# EAGLE design grintch_pcb (EAGLE 9.6.2)
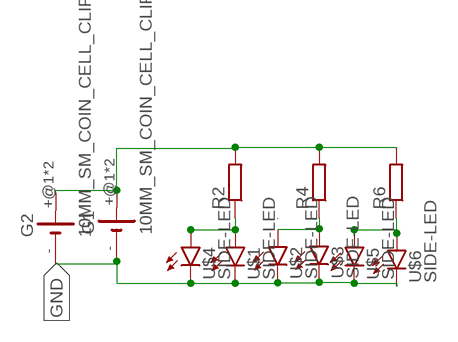
[diagram p0: schematic, sheet 1]

## Parts
G1  10MM_SM_COIN_CELL_CLIP  [10MM_SM_COIN_CELL_CLIP]
G2  10MM_SM_COIN_CELL_CLIP  [10MM_SM_COIN_CELL_CLIP]
R2  R-EU_R0805  [R0805]
R4  R-EU_R0805  [R0805]
R6  R-EU_R0805  [R0805]
U$1  SIDE-LED  [SIDE-LED]
U$2  SIDE-LED  [SIDE-LED]
U$3  SIDE-LED  [SIDE-LED]
U$4  SIDE-LED  [SIDE-LED]
U$5  SIDE-LED  [SIDE-LED]
U$6  SIDE-LED  [SIDE-LED]

## Nets
GND: G1.- G2.- U$1.P$2(C) U$2.P$2(C) U$3.P$2(C) U$4.P$2(C) U$5.P$2(C) U$6.P$2(C)
N$4: G1.+@1(+) G1.+@2(+) G2.+@1(+) G2.+@2(+) R2.2 R4.2 R6.2
N$7: R2.1 U$1.P$1(A) U$4.P$1(A)
N$10: R4.1 U$2.P$1(A) U$3.P$1(A)
N$11: R6.1 U$5.P$1(A) U$6.P$1(A)

## Library data of the parts
G1 G2 = battery:10MM_SM_COIN_CELL_CLIP: Battery cell clip for CR927 Source: KEYSTONE ELECTRONICS CORP. www.keyelco.com, ASTORIA, N.Y. 11105-2017 PART ANME 10mm SM COIN CELl CLIP DWG NO. 3030
R2 R4 R6 = rcl:R-EU_: RESISTOR, European symbol; SPICEPREFIX: R
U$1-U$6 = led:SIDE-LED

## Board
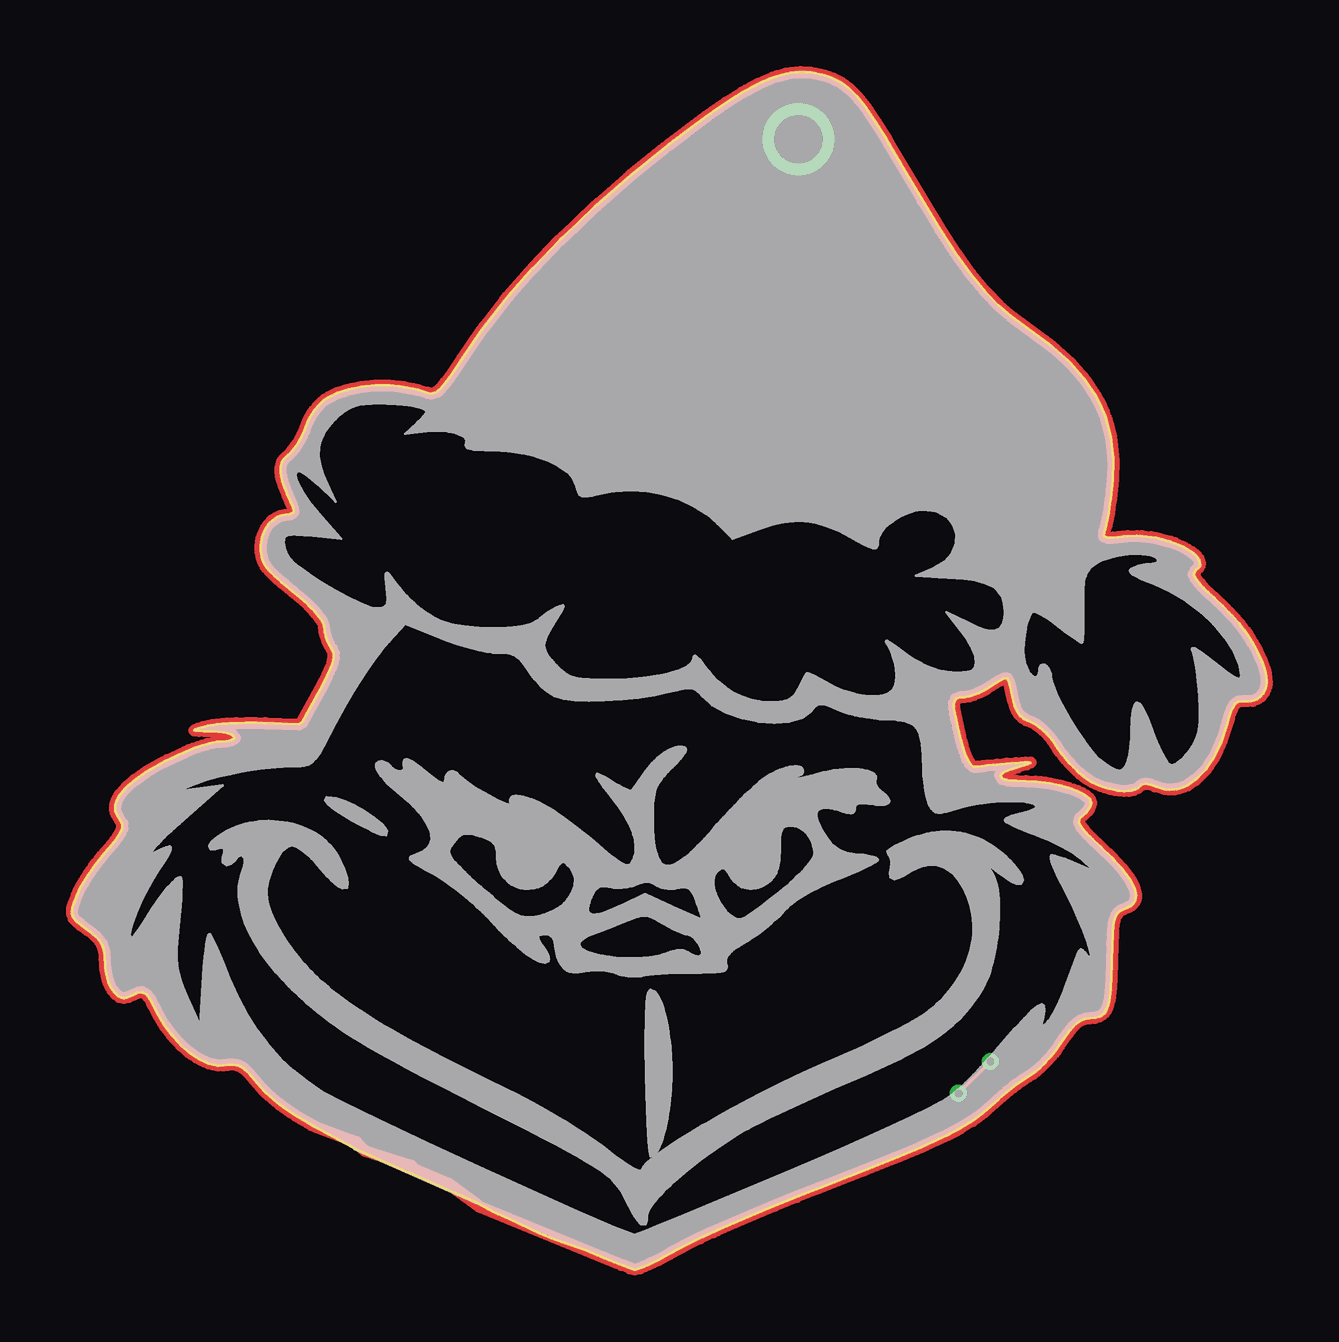
[diagram p1: board, top side]
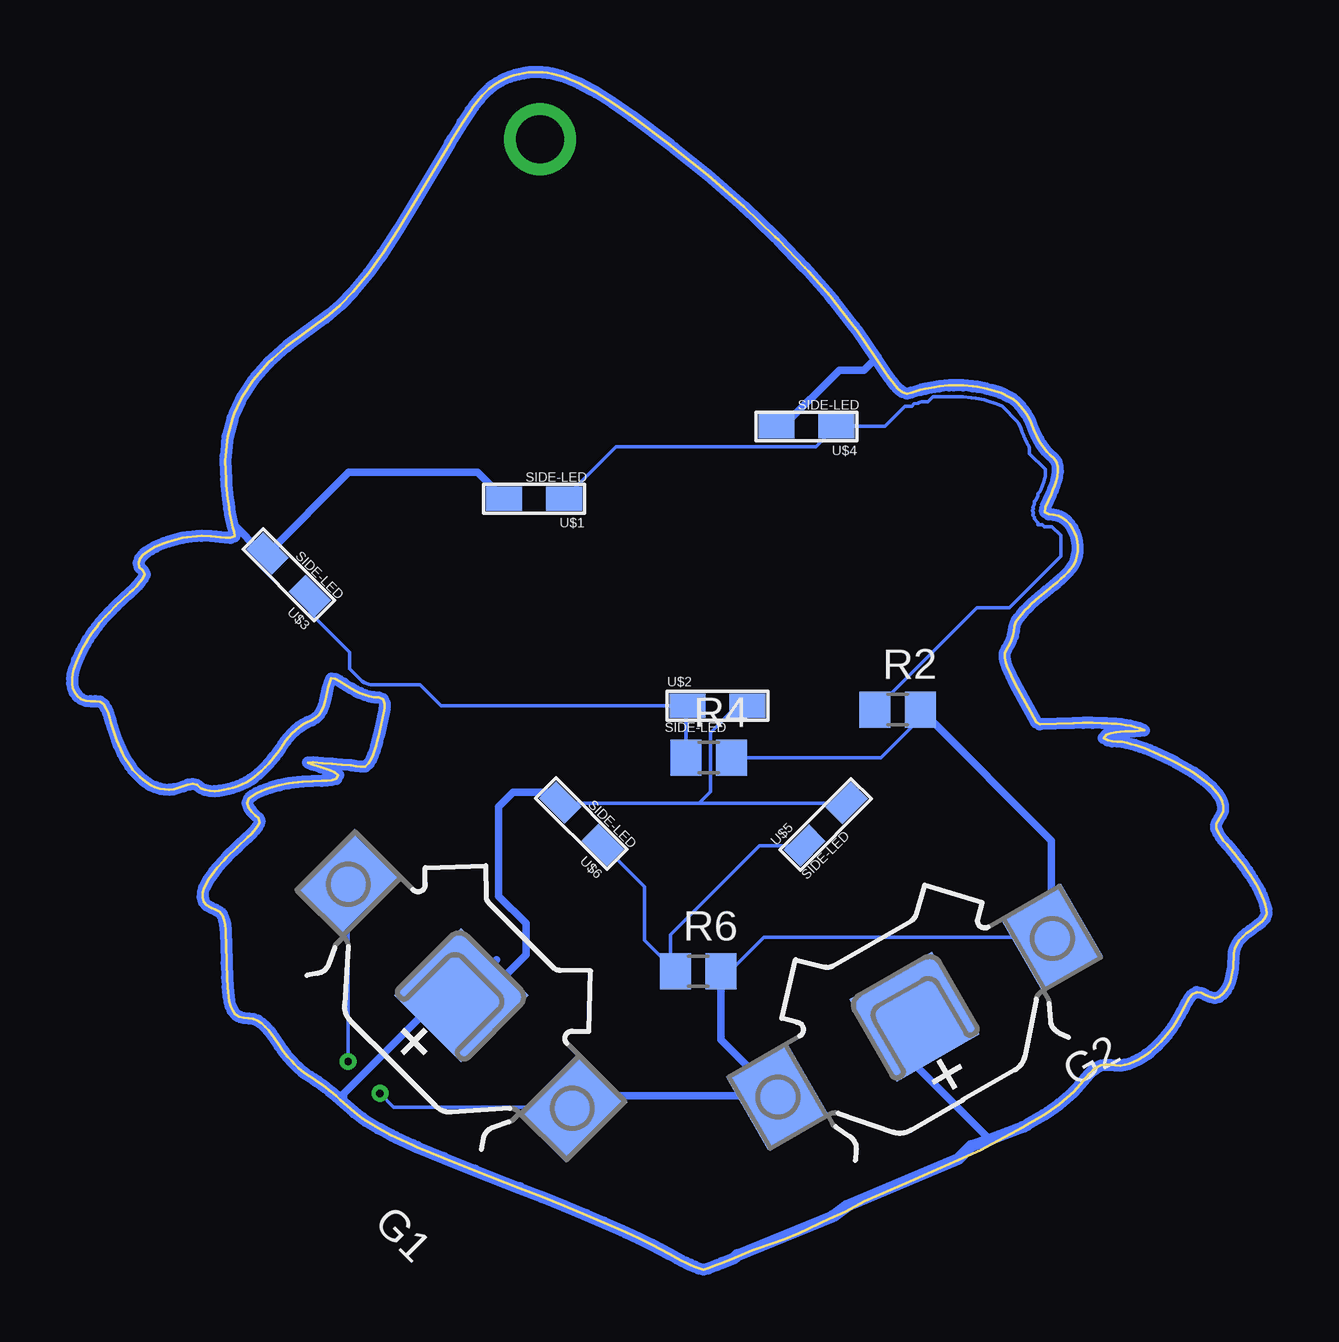
[diagram p2: board, bottom side, seen from below]

Size 49.79 x 49.9 mm. Coordinates in mm from the lower left corner, seen from the top.
Outline: 16.77,2.84 15.04,3.6 14.85,3.68 13.57,4.24 13.38,4.32 11.94,4.98 11.43,5.24 10.16,5.93 9.98,6.03 9.3,6.43 9.13,6.54 8.64,6.89 8.48,7.02 8.03,7.41 7.64,7.86 7.51,8.02 7.38,8.17 7.24,8.31 7.08,8.43 6.9,8.51 6.7,8.54 6.5,8.53 6.3,8.51 6.1,8.5 5.91,8.54 5.71,8.58 5.53,8.66 5.35,8.75 5.18,8.85 5.01,8.96 4.85,9.08 4.55,9.34 4.41,9.48 4.28,9.63 4.15,9.78 3.91,10.1 3.8,10.27 3.6,10.62 3.51,10.79 3.42,10.97 3.32,11.15 3.21,11.32 3.09,11.47 2.92,11.56 2.72,11.53 2.54,11.44 2.36,11.36 2.17,11.31 1.98,11.36 1.82,11.49 1.69,11.64 1.59,11.81 1.52,12 1.46,12.19 1.42,12.38 1.39,12.58 1.38,12.78 1.37,12.98 1.36,13.18 1.31,13.38 1.24,13.56 1.13,13.73 1,13.88 0.84,14.01 0.69,14.13 0.36,14.36 0.21,14.49 0.07,14.64 0,14.82 0.01,15.02 0.06,15.21 0.13,15.4 0.2,15.59 0.28,15.77 0.37,15.94 0.47,16.12 0.58,16.29 0.69,16.46 0.8,16.62 0.91,16.78 1.03,16.95 1.15,17.1 1.28,17.26 1.67,17.72 1.79,17.87 1.91,18.03 2.02,18.2 2.1,18.38 2.09,18.58 1.89,18.92 1.81,19.1 1.81,19.3 1.85,19.49 1.93,19.68 2.04,19.84 2.17,19.99 2.31,20.14 2.61,20.4 2.77,20.51 3.1,20.74 3.27,20.84 3.8,21.14 3.97,21.23 4.7,21.57 4.88,21.64 5.07,21.71 5.26,21.78 5.45,21.84 5.64,21.9 5.83,21.95 6.03,21.99 6.23,22 6.43,22.01 6.62,22.05 6.79,22.15 6.68,22.29 6.49,22.36 6.29,22.39 6.09,22.41 5.89,22.43 5.49,22.44 5.29,22.44 5.1,22.47 5.28,22.55 5.47,22.61 5.66,22.66 5.86,22.69 6.06,22.72 6.26,22.74 6.46,22.75 6.66,22.76 6.86,22.77 7.26,22.78 7.66,22.78 8.06,22.77 9.45,22.72 9.6,22.81 10.37,24.21 10.55,24.56 10.64,24.74 10.73,24.92 10.81,25.11 10.87,25.29 10.92,25.49 10.91,25.69 10.83,25.87 10.73,26.04 10.64,26.22 10.57,26.41 10.53,26.6 10.51,26.8 10.44,26.99 10.33,27.16 10.21,27.31 10.08,27.46 9.94,27.61 9.79,27.75 9.65,27.88 9.5,28.01 9.19,28.27 8.88,28.52 8.72,28.65 8.57,28.78 8.43,28.91 8.28,29.05 8.15,29.21 8.04,29.37 7.95,29.55 7.9,29.74 7.87,29.94 7.87,30.14 7.89,30.34 7.94,30.53 8,30.72 8.09,30.9 8.2,31.06 8.34,31.21 8.5,31.32 8.69,31.4 8.88,31.45 9.08,31.47 9.24,31.57 9.22,31.76 8.97,32.31 8.9,32.49 8.83,32.68 8.77,32.87 8.72,33.07 8.7,33.26 8.7,33.46 8.76,33.65 8.87,33.82 9.02,33.95 9.17,34.09 9.29,34.24 9.4,34.41 9.5,34.58 9.6,34.76 9.68,34.94 9.83,35.31 9.91,35.49 10.02,35.66 10.13,35.83 10.25,35.98 10.39,36.13 10.54,36.26 10.72,36.36 11.08,36.53 11.46,36.65 11.65,36.7 12.04,36.78 12.24,36.8 12.64,36.84 13.04,36.84 13.24,36.84 13.64,36.8 13.83,36.77 14.23,36.7 14.42,36.65 14.8,36.54 15,36.5 15.18,36.57 15.34,36.69 15.48,36.83 15.6,36.99 15.72,37.15 15.95,37.48 16.28,37.98 17.07,39.14 17.19,39.29 18.05,40.4 18.18,40.55 19.1,41.6 19.23,41.75 20.34,42.9 20.48,43.04 21.79,44.28 21.94,44.42 23.29,45.6 24.69,46.73 24.85,46.86 26.45,48.05 27.27,48.62 27.95,49.05 28.12,49.15 28.65,49.43 29.2,49.66 29.39,49.73 29.78,49.83 29.97,49.86 30.17,49.89 30.37,49.9 30.77,49.88 30.97,49.85 31.16,49.81 31.36,49.76 31.55,49.69 31.73,49.62 31.91,49.53 32.09,49.44 32.25,49.32 32.41,49.2 32.69,48.92 32.82,48.76 33.07,48.45 33.18,48.29 33.52,47.79 33.94,47.11 34.04,46.94 35.46,44.53 36.19,43.34 36.85,42.33 36.97,42.17 37.44,41.52 37.56,41.36 38.07,40.75 38.62,40.17 39.08,39.78 39.23,39.66 40.69,38.6 40.84,38.47 41.44,37.94 41.59,37.8 42.12,37.21 42.24,37.05 42.69,36.39 42.78,36.21 43.03,35.66 43.1,35.48 43.3,34.7 43.33,34.51 43.39,33.91 43.4,33.71 43.38,32.91 43.36,32.71 43.34,32.51 43.3,32.12 43.27,31.92 43.24,31.72 43.21,31.52 43.17,31.33 43.14,31.13 43.09,30.94 43.02,30.75 43.01,30.55 43.2,30.49 43.4,30.5 43.59,30.52 43.79,30.54 43.99,30.56 44.39,30.57 44.59,30.57 44.99,30.52 45.19,30.49 45.77,30.34 45.95,30.27 46.32,30.11 46.49,30.01 46.66,29.9 46.82,29.78 46.95,29.63 47.01,29.45 46.98,29.27 46.84,29.13 46.75,28.97 46.84,28.79 46.96,28.63 47.1,28.48 47.23,28.34 47.38,28.2 47.97,27.66 48.25,27.37 48.38,27.23 48.65,26.93 48.77,26.77 48.89,26.61 49,26.44 49.11,26.28 49.22,26.11 49.32,25.93 49.41,25.76 49.58,25.39 49.72,25.02 49.76,24.83 49.79,24.63 49.79,24.43 49.76,24.23 49.68,24.05 49.56,23.89 49.4,23.77 49.21,23.7 49.02,23.68 48.82,23.69 48.62,23.66 48.46,23.55 48.36,23.38 48.28,23.19 48.22,23 48.17,22.81 48.11,22.62 47.92,22.05 47.85,21.86 47.68,21.5 47.59,21.32 47.37,20.99 47.25,20.83 46.98,20.54 46.83,20.4 46.5,20.18 46.31,20.11 46.13,20.04 45.93,20.01 45.73,20 45.53,20.02 45.15,20.13 44.96,20.21 44.77,20.24 44.58,20.19 44.43,20.06 44.25,19.98 44.05,19.95 43.85,19.94 43.65,19.96 43.46,19.99 43.26,20.03 43.07,20.08 42.88,20.15 42.7,20.23 42.52,20.32 42.35,20.42 42.18,20.53 42.03,20.66 41.88,20.79 41.74,20.93 41.6,21.08 41.47,21.23 41.34,21.38 41.22,21.54 41.1,21.7 40.99,21.87 40.88,22.04 40.76,22.19 40.62,22.34 40.48,22.48 40.32,22.61 40.16,22.72 39.98,22.81 39.8,22.88 39.63,22.99 39.48,23.13 39.38,23.3 39.3,23.48 39.25,23.67 39.17,24.06 39.12,24.26 39.06,24.45 38.98,24.63 38.81,24.62 38.64,24.52 38.47,24.42 38.13,24.2 37.96,24.1 37.78,24.02 37.59,23.95 37.4,23.89 37.2,23.85 37,23.84 36.83,23.77 36.75,23.59 36.76,23.39 36.8,23.19 36.83,22.99 36.92,22.6 37.02,22.21 37.07,22.02 37.12,21.83 37.18,21.64 37.24,21.45 37.32,21.26 37.42,21.09 37.56,20.96 37.76,20.95 37.96,20.98 38.16,21.01 38.55,21.05 38.95,21.08 39.35,21.11 39.75,21.13 39.95,21.13 39.79,21.05 39.41,20.93 39.22,20.87 39.03,20.8 38.85,20.72 38.69,20.6 38.78,20.45 38.97,20.4 39.17,20.38 39.37,20.36 39.77,20.35 40.17,20.33 40.37,20.31 40.57,20.29 40.76,20.26 41.16,20.18 41.54,20.08 41.73,20.01 41.92,19.94 42.09,19.85 42.27,19.75 42.42,19.62 42.48,19.43 42.42,19.24 42.3,19.08 42.16,18.94 42.01,18.81 41.97,18.62 42.06,18.45 42.19,18.29 42.33,18.15 42.47,18.01 42.91,17.6 43.34,17.18 43.47,17.03 43.74,16.74 43.87,16.58 44.1,16.26 44.29,15.91 44.34,15.71 44.35,15.52 44.3,15.33 44.17,15.17 43.99,15.08 43.81,15 43.64,14.91 43.51,14.75 43.45,14.56 43.41,14.37 43.39,14.17 43.38,13.97 43.36,13.57 43.34,12.77 43.33,12.17 43.3,11.77 43.29,11.57 43.26,11.37 43.23,11.18 43.18,10.98 43.1,10.8 42.99,10.64 42.82,10.54 42.63,10.49 42.43,10.47 42.23,10.45 42.05,10.37 41.88,10.26 41.73,10.12 41.6,9.97 41.48,9.81 41.36,9.65 41.14,9.32 41.02,9.16 40.9,9 40.77,8.85 40.64,8.7 40.5,8.55 40.36,8.41 40.21,8.28 40.05,8.16 39.88,8.05 39.71,7.94 39.55,7.83 39.39,7.71 39.23,7.59 39.07,7.47 38.92,7.34 38.76,7.21 38.61,7.08 38.46,6.95 38.02,6.55 37.7,6.31 37.53,6.19 37.02,5.88 36.49,5.61 36.31,5.52 35.58,5.19 35.4,5.11 34.29,4.64 32.99,4.12 31.13,3.4 30.2,3.03 29.27,2.66 28.35,2.27 27.62,1.96 26.88,1.64 26.7,1.55 26.16,1.3 25.62,1.04 25.27,0.85 24.92,0.66 24.56,0.47 24.39,0.38 24.21,0.29 24.03,0.2 23.84,0.12 23.66,0.05 23.46,0 23.27,0.05 22.9,0.2 22.71,0.27 22.16,0.5 21.42,0.81 21.23,0.88 20.1,1.26 19.48,1.51 18.23,2.11 17.56,2.41 16.77,2.84
Copper layers (1*16): Top 0.035mm / dielectric 1.5mm / Bottom 0.035mm
Design rules "default *": minimum track width 6mil, minimum drill 0.35mm, track to track 6mil, track to pad 6mil, pad to pad 6mil, via to via 6mil, smd to smd 6mil, copper to edge 10mil, drill to drill 6mil, minimum pad ring 10mil, minimum via ring 8mil, stop-mask expansion 4mil, vias tented up to drill 20mil, thermal gap 10mil

### Footprints (pad centres in the part's own frame; a part is rotated, then mirrored left to right if it is on the bottom)
10MM_SM_COIN_CELL_CLIP = smd 2.9 x 3.5: +@1 -6.6,0; +@2 6.6,0 | smd 3.96 x 3.96: - 0,0
R0805 = smd 1.3 x 1.5: 1 -0.95,0; 2 0.95,0
SIDE-LED = smd 1 x 1.5: P$1 0,-1.25; P$2 0,1.25

### Placement (x,y rotation side)
G1  33.57,11.43 135 bottom
G2  14.68,10.54 210 bottom
R2  15.38,23.33 0 bottom
R4  23.25,21.33 0 bottom
R6  23.69,12.43 0 bottom
U$1  30.53,32.12 90 bottom
U$2  22.89,23.49 270 bottom
U$3  40.76,28.95 45 bottom
U$4  19.18,35.13 90 bottom
U$5  18.38,18.55 315 bottom
U$6  28.56,18.58 45 bottom

### Tracks (layer width: path | path; a pad name or v marks a point on that pad's centre or on a via)
GND
  Bottom 0.152: U$5.P$2 23.67,19.44 | 23.67,19.44 29.41,19.44 29.61,19.63 | 23.67,19.44 23.19,19.92 23.19,22.37 22.07,23.49 U$2.P$2
  Bottom 0.305: 33.99,10.54 34.22,10.77 34.22,10.78 G1.- | 32.09,12.91 33.45,11.55 | 33.45,11.55 G1.- | 13.63,10.27 14.9,10.27 15.17,10.54 G2.- 14.68,8.56 11.53,5.42 | U$6.P$2 29.61,19.63 29.87,19.89 31.4,19.89 32.01,19.28 32.01,15.56 30.87,14.42 30.87,13.12 33.22,10.77 33.45,11 33.45,11.55 | G1.- 34.36,11.43 38.46,7.33 38.46,6.95 | U$4.P$2 20.15,35.13 17.8,37.48 16.78,37.48 16.28,37.98 | U$1.P$2 32.88,33.22 38.25,33.22 U$3.P$2 41.84,29.84 43.14,31.13
  Bottom 0.5: 18.08,2.22 17.49,2.66 12.84,4.63 12.31,5.16 11.86,5.3 11.53,5.42 10.16,5.93 9.98,6.03 9.3,6.43 9.13,6.54 8.64,6.89 8.48,7.02 8.03,7.41 7.64,7.86 7.51,8.02 7.38,8.17 7.24,8.31 7.08,8.43 6.9,8.51 6.7,8.54 6.5,8.53 6.3,8.51 6.1,8.5 5.91,8.54 5.71,8.58 5.53,8.66 5.35,8.75 5.18,8.85 5.01,8.96 4.85,9.08 4.55,9.34 4.41,9.48 4.28,9.63 4.15,9.78 3.91,10.1 3.8,10.27 3.6,10.62 3.51,10.79 3.42,10.97 3.32,11.15 3.21,11.32 3.09,11.47 2.92,11.56 2.72,11.53 2.54,11.44 2.36,11.36 2.17,11.31 1.98,11.36 1.82,11.49 1.69,11.64 1.59,11.81 1.52,12 1.46,12.19 1.42,12.38 1.39,12.58 1.38,12.78 1.37,12.98 1.36,13.18 1.31,13.38 1.24,13.56 1.13,13.73 1,13.88 0.84,14.01 0.69,14.13 0.36,14.36 0.21,14.49 0.07,14.64 0,14.82 0.01,15.02 0.06,15.21 0.13,15.4 0.2,15.59 0.28,15.77 0.37,15.94 0.47,16.12 0.58,16.29 0.69,16.46 0.8,16.62 0.91,16.78 1.03,16.95 1.15,17.1 1.28,17.26 1.67,17.72 1.79,17.87 1.91,18.03 2.02,18.2 2.1,18.38 2.09,18.58 1.89,18.92 1.81,19.1 1.81,19.3 1.85,19.49 1.93,19.68 2.04,19.84 2.17,19.99 2.31,20.14 2.61,20.4 2.77,20.51 3.1,20.74 3.27,20.84 3.8,21.14 3.97,21.23 4.7,21.57 4.88,21.64 5.07,21.71 5.26,21.78 5.45,21.84 5.64,21.9 5.83,21.95 6.03,21.99 6.23,22 6.43,22.01 6.62,22.05 6.79,22.15 6.68,22.29 6.49,22.36 6.29,22.39 6.09,22.41 5.89,22.43 5.49,22.44 5.29,22.44 5.1,22.47 5.28,22.55 5.47,22.61 5.66,22.66 5.86,22.69 6.06,22.72 6.26,22.74 6.46,22.75 6.66,22.76 6.86,22.77 7.26,22.78 7.66,22.78 8.06,22.77 9.45,22.72 9.6,22.81 10.37,24.21 10.55,24.56 10.64,24.74 10.73,24.92 10.81,25.11 10.87,25.29 10.92,25.49 10.91,25.69 10.83,25.87 10.73,26.04 10.64,26.22 10.57,26.41 10.53,26.6 10.51,26.8 10.44,26.99 10.33,27.16 10.21,27.31 10.08,27.46 9.94,27.61 9.79,27.75 9.65,27.88 9.5,28.01 9.19,28.27 8.88,28.52 8.72,28.65 8.57,28.78 8.43,28.91 8.28,29.05 8.15,29.21 8.04,29.37 7.95,29.55 7.9,29.74 7.87,29.94 7.87,30.14 7.89,30.34 7.94,30.53 8,30.72 8.09,30.9 8.2,31.06 8.34,31.21 8.5,31.32 8.69,31.4 8.88,31.45 9.08,31.47 9.24,31.57 9.22,31.76 8.97,32.31 8.9,32.49 8.83,32.68 8.77,32.87 8.72,33.07 8.7,33.26 8.7,33.46 8.76,33.65 8.87,33.82 9.02,33.95 9.17,34.09 9.29,34.24 9.4,34.41 9.5,34.58 9.6,34.76 9.68,34.94 9.83,35.31 9.91,35.49 10.02,35.66 10.13,35.83 10.25,35.98 10.39,36.13 10.54,36.26 10.72,36.36 11.08,36.53 11.46,36.65 11.65,36.7 12.04,36.78 12.24,36.8 12.64,36.84 13.04,36.84 13.24,36.84 13.64,36.8 13.83,36.77 14.23,36.7 14.42,36.65 14.8,36.54 15,36.5 15.18,36.57 15.34,36.69 15.48,36.83 15.6,36.99 15.72,37.15 15.95,37.48 16.28,37.98 17.07,39.14 17.19,39.29 18.05,40.4 18.18,40.55 19.1,41.6 19.23,41.75 20.34,42.9 20.48,43.04 21.79,44.28 21.94,44.42 23.29,45.6 24.69,46.73 24.85,46.86 26.45,48.05 27.27,48.62 27.95,49.05 28.12,49.15 28.65,49.43 29.2,49.66 29.39,49.73 29.78,49.83 29.97,49.86 30.17,49.89 30.37,49.9 30.77,49.88 30.97,49.85 31.16,49.81 31.36,49.76 31.55,49.69 31.73,49.62 31.91,49.53 32.09,49.44 32.25,49.32 32.41,49.2 32.69,48.92 32.82,48.76 33.07,48.45 33.18,48.29 33.52,47.79 33.94,47.11 34.04,46.94 35.46,44.53 36.19,43.34 36.85,42.33 36.97,42.17 37.44,41.52 37.56,41.36 38.07,40.75 38.62,40.17 39.08,39.78 39.23,39.66 40.69,38.6 40.84,38.47 41.44,37.94 41.59,37.8 42.12,37.21 42.24,37.05 42.69,36.39 42.78,36.21 43.03,35.66 43.1,35.48 43.3,34.7 43.33,34.51 43.39,33.91 43.4,33.71 43.38,32.91 43.36,32.71 43.34,32.51 43.3,32.12 43.27,31.92 43.24,31.72 43.21,31.52 43.17,31.33 43.14,31.13 43.09,30.94 43.02,30.75 43.01,30.55 43.2,30.49 43.4,30.5 43.59,30.52 43.79,30.54 43.99,30.56 44.39,30.57 44.59,30.57 44.99,30.52 45.19,30.49 45.77,30.34 45.95,30.27 46.32,30.11 46.49,30.01 46.66,29.9 46.82,29.78 46.95,29.63 47.01,29.45 46.98,29.27 46.84,29.13 46.75,28.97 46.84,28.79 46.96,28.63 47.1,28.48 47.23,28.34 47.38,28.2 47.97,27.66 48.25,27.37 48.38,27.23 48.65,26.93 48.77,26.77 48.89,26.61 49,26.44 49.11,26.28 49.22,26.11 49.32,25.93 49.41,25.76 49.58,25.39 49.72,25.02 49.76,24.83 49.79,24.63 49.79,24.43 49.76,24.23 49.68,24.05 49.56,23.89 49.4,23.77 49.21,23.7 49.02,23.68 48.82,23.69 48.62,23.66 48.46,23.55 48.36,23.38 48.28,23.19 48.22,23 48.17,22.81 48.11,22.62 47.92,22.05 47.85,21.86 47.68,21.5 47.59,21.32 47.37,20.99 47.25,20.83 46.98,20.54 46.83,20.4 46.5,20.18 46.31,20.11 46.13,20.04 45.93,20.01 45.73,20 45.53,20.02 45.15,20.13 44.96,20.21 44.77,20.24 44.58,20.19 44.43,20.06 44.25,19.98 44.05,19.95 43.85,19.94 43.65,19.96 43.46,19.99 43.26,20.03 43.07,20.08 42.88,20.15 42.7,20.23 42.52,20.32 42.35,20.42 42.18,20.53 42.03,20.66 41.88,20.79 41.74,20.93 41.6,21.08 41.47,21.23 41.34,21.38 41.22,21.54 41.1,21.7 40.99,21.87 40.88,22.04 40.76,22.19 40.62,22.34 40.48,22.48 40.32,22.61 40.16,22.72 39.98,22.81 39.8,22.88 39.63,22.99 39.48,23.13 39.38,23.3 39.3,23.48 39.25,23.67 39.17,24.06 39.12,24.26 39.06,24.45 38.98,24.63 38.81,24.62 38.64,24.52 38.47,24.42 38.13,24.2 37.96,24.1 37.78,24.02 37.59,23.95 37.4,23.89 37.2,23.85 37,23.84 36.83,23.77 36.75,23.59 36.76,23.39 36.8,23.19 36.83,22.99 36.92,22.6 37.02,22.21 37.07,22.02 37.12,21.83 37.18,21.64 37.24,21.45 37.32,21.26 37.42,21.09 37.56,20.96 37.76,20.95 37.96,20.98 38.16,21.01 38.55,21.05 38.95,21.08 39.35,21.11 39.75,21.13 39.95,21.13 39.79,21.05 39.41,20.93 39.22,20.87 39.03,20.8 38.85,20.72 38.69,20.6 38.78,20.45 38.97,20.4 39.17,20.38 39.37,20.36 39.77,20.35 40.17,20.33 40.37,20.31 40.57,20.29 40.76,20.26 41.16,20.18 41.54,20.08 41.73,20.01 41.92,19.94 42.09,19.85 42.27,19.75 42.42,19.62 42.48,19.43 42.42,19.24 42.3,19.08 42.16,18.94 42.01,18.81 41.97,18.62 42.06,18.45 42.19,18.29 42.33,18.15 42.47,18.01 42.91,17.6 43.34,17.18 43.47,17.03 43.74,16.74 43.87,16.58 44.1,16.26 44.29,15.91 44.34,15.71 44.35,15.52 44.3,15.33 44.17,15.17 43.99,15.08 43.81,15 43.64,14.91 43.51,14.75 43.45,14.56 43.41,14.37 43.39,14.17 43.38,13.97 43.36,13.57 43.34,12.77 43.33,12.17 43.3,11.77 43.29,11.57 43.26,11.37 43.23,11.18 43.18,10.98 43.1,10.8 42.99,10.64 42.82,10.54 42.63,10.49 42.43,10.47 42.23,10.45 42.05,10.37 41.88,10.26 41.73,10.12 41.6,9.97 41.48,9.81 41.36,9.65 41.14,9.32 41.02,9.16 40.9,9 40.77,8.85 40.64,8.7 40.5,8.55 40.36,8.41 40.21,8.28 40.05,8.16 39.88,8.05 39.71,7.94 39.55,7.83 39.39,7.71 39.23,7.59 39.07,7.47 38.92,7.34 38.76,7.21 38.66,7.13 38.61,7.08 38.46,6.95 38.02,6.55 37.7,6.31 37.53,6.19 37.02,5.88 36.49,5.61 36.31,5.52 35.58,5.19 35.4,5.11 34.29,4.64 32.99,4.12 31.13,3.4 30.2,3.03 29.27,2.66 28.35,2.27 27.62,1.96 26.88,1.64 26.7,1.55 26.16,1.3 25.62,1.04 25.27,0.85 24.92,0.66 24.56,0.47 24.39,0.38 24.21,0.29 24.03,0.2 23.84,0.12 23.66,0.05 23.46,0 23.27,0.05 22.9,0.2 22.71,0.27 22.16,0.5 22.06,0.6 18.08,2.22
N$1  (via drill 2)
  other vias: 30.28,47.1
N$2
  Top 0.5: 16.96,2.62 16.93,2.65 15.68,3.58 14.3,4.16 14.13,4.33 12.22,4.94 11.85,5.31 11.66,5.37 10.16,5.93 9.98,6.03 9.3,6.43 9.13,6.54 8.64,6.89 8.48,7.02 8.03,7.41 7.64,7.86 7.51,8.02 7.38,8.17 7.24,8.31 7.08,8.43 6.9,8.51 6.7,8.54 6.5,8.53 6.3,8.51 6.1,8.5 5.91,8.54 5.71,8.58 5.53,8.66 5.35,8.75 5.18,8.85 5.01,8.96 4.85,9.08 4.55,9.34 4.41,9.48 4.28,9.63 4.15,9.78 3.91,10.1 3.8,10.27 3.6,10.62 3.51,10.79 3.42,10.97 3.32,11.15 3.21,11.32 3.09,11.47 2.92,11.56 2.72,11.53 2.54,11.44 2.36,11.36 2.17,11.31 1.98,11.36 1.82,11.49 1.69,11.64 1.59,11.81 1.52,12 1.46,12.19 1.42,12.38 1.39,12.58 1.38,12.78 1.37,12.98 1.36,13.18 1.31,13.38 1.24,13.56 1.13,13.73 1,13.88 0.84,14.01 0.69,14.13 0.36,14.36 0.21,14.49 0.07,14.64 0,14.82 0.01,15.02 0.06,15.21 0.13,15.4 0.2,15.59 0.28,15.77 0.37,15.94 0.47,16.12 0.58,16.29 0.69,16.46 0.8,16.62 0.91,16.78 1.03,16.95 1.15,17.1 1.28,17.26 1.67,17.72 1.79,17.87 1.91,18.03 2.02,18.2 2.1,18.38 2.09,18.58 1.89,18.92 1.81,19.1 1.81,19.3 1.85,19.49 1.93,19.68 2.04,19.84 2.17,19.99 2.31,20.14 2.61,20.4 2.77,20.51 3.1,20.74 3.27,20.84 3.8,21.14 3.97,21.23 4.7,21.57 4.88,21.64 5.07,21.71 5.26,21.78 5.45,21.84 5.64,21.9 5.83,21.95 6.03,21.99 6.23,22 6.43,22.01 6.62,22.05 6.79,22.15 6.68,22.29 6.49,22.36 6.29,22.39 6.09,22.41 5.89,22.43 5.49,22.44 5.29,22.44 5.1,22.47 5.28,22.55 5.47,22.61 5.66,22.66 5.86,22.69 6.06,22.72 6.26,22.74 6.46,22.75 6.66,22.76 6.86,22.77 7.26,22.78 7.66,22.78 8.06,22.77 9.45,22.72 9.6,22.81 10.37,24.21 10.55,24.56 10.64,24.74 10.73,24.92 10.81,25.11 10.87,25.29 10.92,25.49 10.91,25.69 10.83,25.87 10.73,26.04 10.64,26.22 10.57,26.41 10.53,26.6 10.51,26.8 10.44,26.99 10.33,27.16 10.21,27.31 10.08,27.46 9.94,27.61 9.79,27.75 9.65,27.88 9.5,28.01 9.19,28.27 8.88,28.52 8.72,28.65 8.57,28.78 8.43,28.91 8.28,29.05 8.15,29.21 8.04,29.37 7.95,29.55 7.9,29.74 7.87,29.94 7.87,30.14 7.89,30.34 7.94,30.53 8,30.72 8.09,30.9 8.2,31.06 8.34,31.21 8.5,31.32 8.69,31.4 8.88,31.45 9.08,31.47 9.24,31.57 9.22,31.76 8.97,32.31 8.9,32.49 8.83,32.68 8.77,32.87 8.72,33.07 8.7,33.26 8.7,33.46 8.76,33.65 8.87,33.82 9.02,33.95 9.17,34.09 9.29,34.24 9.4,34.41 9.5,34.58 9.6,34.76 9.68,34.94 9.83,35.31 9.91,35.49 10.02,35.66 10.13,35.83 10.25,35.98 10.39,36.13 10.54,36.26 10.72,36.36 11.08,36.53 11.46,36.65 11.65,36.7 12.04,36.78 12.24,36.8 12.64,36.84 13.04,36.84 13.24,36.84 13.64,36.8 13.83,36.77 14.23,36.7 14.42,36.65 14.8,36.54 15,36.5 15.18,36.57 15.34,36.69 15.48,36.83 15.6,36.99 15.72,37.15 15.95,37.48 16.28,37.98 17.07,39.14 17.19,39.29 18.05,40.4 18.18,40.55 19.1,41.6 19.23,41.75 20.34,42.9 20.48,43.04 21.79,44.28 21.94,44.42 23.29,45.6 24.69,46.73 24.85,46.86 26.45,48.05 27.27,48.62 27.95,49.05 28.12,49.15 28.65,49.43 29.2,49.66 29.39,49.73 29.78,49.83 29.97,49.86 30.17,49.89 30.37,49.9 30.77,49.88 30.97,49.85 31.16,49.81 31.36,49.76 31.55,49.69 31.73,49.62 31.91,49.53 32.09,49.44 32.25,49.32 32.41,49.2 32.69,48.92 32.82,48.76 33.07,48.45 33.18,48.29 33.52,47.79 33.94,47.11 34.04,46.94 35.46,44.53 36.19,43.34 36.85,42.33 36.97,42.17 37.44,41.52 37.56,41.36 38.07,40.75 38.62,40.17 39.08,39.78 39.23,39.66 40.69,38.6 40.84,38.47 41.44,37.94 41.59,37.8 42.12,37.21 42.24,37.05 42.69,36.39 42.78,36.21 43.03,35.66 43.1,35.48 43.3,34.7 43.33,34.51 43.39,33.91 43.4,33.71 43.38,32.91 43.36,32.71 43.34,32.51 43.3,32.12 43.27,31.92 43.24,31.72 43.21,31.52 43.17,31.33 43.14,31.13 43.09,30.94 43.02,30.75 43.01,30.55 43.2,30.49 43.4,30.5 43.59,30.52 43.79,30.54 43.99,30.56 44.39,30.57 44.59,30.57 44.99,30.52 45.19,30.49 45.77,30.34 45.95,30.27 46.32,30.11 46.49,30.01 46.66,29.9 46.82,29.78 46.95,29.63 47.01,29.45 46.98,29.27 46.84,29.13 46.75,28.97 46.84,28.79 46.96,28.63 47.1,28.48 47.23,28.34 47.38,28.2 47.97,27.66 48.25,27.37 48.38,27.23 48.65,26.93 48.77,26.77 48.89,26.61 49,26.44 49.11,26.28 49.22,26.11 49.32,25.93 49.41,25.76 49.58,25.39 49.72,25.02 49.76,24.83 49.79,24.63 49.79,24.43 49.76,24.23 49.68,24.05 49.56,23.89 49.4,23.77 49.21,23.7 49.02,23.68 48.82,23.69 48.62,23.66 48.46,23.55 48.36,23.38 48.28,23.19 48.22,23 48.17,22.81 48.11,22.62 47.92,22.05 47.85,21.86 47.68,21.5 47.59,21.32 47.37,20.99 47.25,20.83 46.98,20.54 46.83,20.4 46.5,20.18 46.31,20.11 46.13,20.04 45.93,20.01 45.73,20 45.53,20.02 45.15,20.13 44.96,20.21 44.77,20.24 44.58,20.19 44.43,20.06 44.25,19.98 44.05,19.95 43.85,19.94 43.65,19.96 43.46,19.99 43.26,20.03 43.07,20.08 42.88,20.15 42.7,20.23 42.52,20.32 42.35,20.42 42.18,20.53 42.03,20.66 41.88,20.79 41.74,20.93 41.6,21.08 41.47,21.23 41.34,21.38 41.22,21.54 41.1,21.7 40.99,21.87 40.88,22.04 40.76,22.19 40.62,22.34 40.48,22.48 40.32,22.61 40.16,22.72 39.98,22.81 39.8,22.88 39.63,22.99 39.48,23.13 39.38,23.3 39.3,23.48 39.25,23.67 39.17,24.06 39.12,24.26 39.06,24.45 38.98,24.63 38.81,24.62 38.64,24.52 38.47,24.42 38.13,24.2 37.96,24.1 37.78,24.02 37.59,23.95 37.4,23.89 37.2,23.85 37,23.84 36.83,23.77 36.75,23.59 36.76,23.39 36.8,23.19 36.83,22.99 36.92,22.6 37.02,22.21 37.07,22.02 37.12,21.83 37.18,21.64 37.24,21.45 37.32,21.26 37.42,21.09 37.56,20.96 37.76,20.95 37.96,20.98 38.16,21.01 38.55,21.05 38.95,21.08 39.35,21.11 39.75,21.13 39.95,21.13 39.79,21.05 39.41,20.93 39.22,20.87 39.03,20.8 38.85,20.72 38.69,20.6 38.78,20.45 38.97,20.4 39.17,20.38 39.37,20.36 39.77,20.35 40.17,20.33 40.37,20.31 40.57,20.29 40.76,20.26 41.16,20.18 41.54,20.08 41.73,20.01 41.92,19.94 42.09,19.85 42.27,19.75 42.42,19.62 42.48,19.43 42.42,19.24 42.3,19.08 42.16,18.94 42.01,18.81 41.97,18.62 42.06,18.45 42.19,18.29 42.33,18.15 42.47,18.01 42.91,17.6 43.34,17.18 43.47,17.03 43.74,16.74 43.87,16.58 44.1,16.26 44.29,15.91 44.34,15.71 44.35,15.52 44.3,15.33 44.17,15.17 43.99,15.08 43.81,15 43.64,14.91 43.51,14.75 43.45,14.56 43.41,14.37 43.39,14.17 43.38,13.97 43.36,13.57 43.34,12.77 43.33,12.17 43.3,11.77 43.29,11.57 43.26,11.37 43.23,11.18 43.18,10.98 43.1,10.8 42.99,10.64 42.82,10.54 42.63,10.49 42.43,10.47 42.23,10.45 42.05,10.37 41.88,10.26 41.73,10.12 41.6,9.97 41.48,9.81 41.36,9.65 41.14,9.32 41.02,9.16 40.9,9 40.77,8.85 40.64,8.7 40.5,8.55 40.36,8.41 40.21,8.28 40.05,8.16 39.88,8.05 39.71,7.94 39.55,7.83 39.39,7.71 39.23,7.59 39.07,7.47 38.92,7.34 38.76,7.21 38.61,7.08 38.46,6.95 38.02,6.55 37.7,6.31 37.53,6.19 37.02,5.88 36.49,5.61 36.31,5.52 35.58,5.19 35.4,5.11 34.29,4.64 32.99,4.12 31.13,3.4 30.2,3.03 29.27,2.66 28.35,2.27 27.62,1.96 26.88,1.64 26.7,1.55 26.16,1.3 25.62,1.04 25.27,0.85 24.92,0.66 24.56,0.47 24.39,0.38 24.21,0.29 24.03,0.2 23.84,0.12 23.66,0.05 23.46,0 23.27,0.05 22.9,0.2 22.71,0.27 22.16,0.5 16.96,2.62
N$4  (via drill 0.3)
  Top 0.152: v36.96,7.34 v38.28,8.66 v38.28,8.67
  Bottom 0.152: 22.56,12.61 R6.2 | G2.+@1 20.96,13.84 22.74,12.06 | R4.2 16.07,21.33 14.25,23.15 | G1.+@1 36.38,6.76 v36.96,7.34 | v38.28,8.67 38.28,15.95 38.74,16.41 38.55,16.41 G1.+@2
  Bottom 0.305: R4.2 22.3,21.91 | G2.+@1 8.96,17.87 14.25,23.15 R2.2 | G1.+@1 28.42,7.24 G2.+@2 22.74,9.59 22.74,12.06 R6.2
N$7
  Bottom 0.152: R2.1 12.08,27.58 10.73,27.58 8.58,29.73 8.58,30.59 8.94,30.96 9.27,30.96 9.34,31.03 9.53,31.03 9.53,31.13 9.68,31.28 9.68,31.35 9.74,31.42 9.72,31.53 9.75,31.65 9.71,31.71 9.74,31.77 9.68,31.89 9.67,32.01 9.61,32.06 9.53,32.24 9.53,32.33 9.45,32.4 9.41,32.49 9.35,32.67 9.28,32.83 9.23,33 9.22,33.04 9.22,33.35 9.88,34 9.88,34.25 9.91,34.3 9.91,34.32 9.92,34.35 9.94,34.37 9.95,34.38 9.98,34.44 10.02,34.51 10.01,34.52 10.03,34.55 10.04,34.57 10.05,34.58 10.08,34.64 10.11,34.71 10.11,34.72 10.12,34.75 10.2,34.92 10.19,34.93 10.26,35.12 10.34,35.26 10.38,35.33 11.01,35.97 11.25,36.08 11.59,36.19 11.76,36.24 12.12,36.31 12.29,36.33 12.66,36.36 12.7,36.36 13.91,36.36 14.11,36.16 14.39,36.16 14.5,36.13 14.52,36.11 14.69,36.07 14.78,35.98 15.07,35.98 15.92,35.13 U$4.P$1 18.78,34.28 27.12,34.28 U$1.P$1
  Bottom 0.305: R2.1 16.33,23.83
N$10
  Bottom 0.152: U$3.P$1 39.87,27.38 38.22,25.72 38.22,25.03 37.7,24.51 37.59,24.46 37.43,24.4 37.35,24.37 35.29,24.37 34.41,23.49 U$2.P$1 24.2,23.43 R4.1
N$11
  Bottom 0.152: U$6.P$1 25.93,15.96 25.93,13.73 24.84,12.63 | 24.84,12.63 R6.1 | U$5.P$1 21.13,17.67 24.84,13.96 24.84,12.63